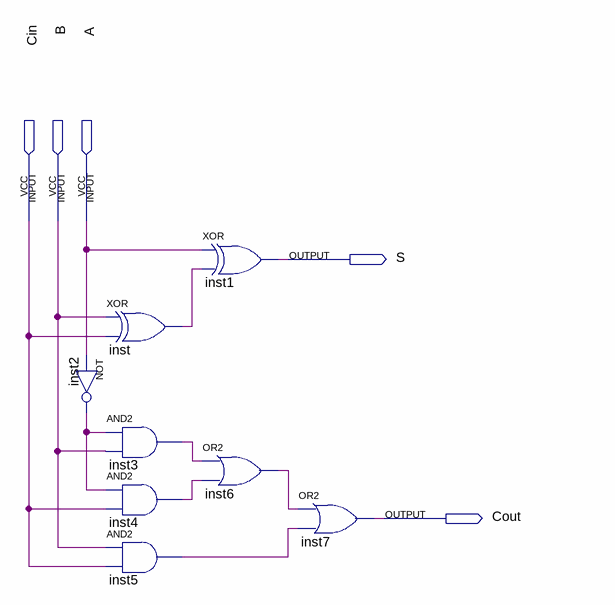
[diagram p0: schematic sheet]
// Quartus schematic SubtratorCompleto.bdf as structural Verilog: 8 symbols, 5 pins
module SubtratorCompleto (
  input  Cin,
  input  B,
  input  A,
  output S,
  output Cout
);

  wire inst2_out, inst3_out, inst4_out, inst5_out, inst6_out, inst_out;

  xor inst (inst_out, B, Cin);
  not inst2 (inst2_out, A);
  and inst3 (inst3_out, inst2_out, B);
  and inst4 (inst4_out, inst2_out, Cin);
  and inst5 (inst5_out, B, Cin);
  xor inst1 (S, A, inst_out);
  or inst6 (inst6_out, inst3_out, inst4_out);
  or inst7 (Cout, inst6_out, inst5_out);
endmodule
